# EAGLE design camera (EAGLE 9.6.2)
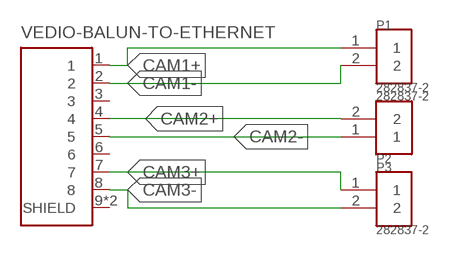
[diagram p0: schematic, sheet 1]

## Parts
P1  282837-2  [TE_282837-2]
P2  282837-2  [TE_282837-2]
P3  282837-2  [TE_282837-2]
VEDIO-BALUN-TO-ETHERNET  RJ45-8N-B  [TE_RJ45-8N-B]

## Nets
CAM1+: P1.1 VEDIO-BALUN-TO-ETHERNET.1
CAM1-: P1.2 VEDIO-BALUN-TO-ETHERNET.2
CAM2+: P2.2 VEDIO-BALUN-TO-ETHERNET.4
CAM2-: P2.1 VEDIO-BALUN-TO-ETHERNET.5
CAM3+: P3.1 VEDIO-BALUN-TO-ETHERNET.7
CAM3-: P3.2 VEDIO-BALUN-TO-ETHERNET.8
Unconnected: VEDIO-BALUN-TO-ETHERNET.3 VEDIO-BALUN-TO-ETHERNET.6 VEDIO-BALUN-TO-ETHERNET.9(SHIELD) VEDIO-BALUN-TO-ETHERNET.10(SHIELD)

## Library data of the parts
P1-P3 = block terminal:282837-2: TERM BLOCK 5.08MM 2POS SIDE ENTY Check availability <https://pricing.snapeda.com/parts/282837-2/TE%20Connectivity/view-part?ref=eda>; AVAILABILITY: In Stock; CHECK_PRICES: https://www.snapeda.com/parts/282837-2/TE+Connectivity+AMP+Connectors/view-part/?ref=eda; COMMENT: 282837-2; DESCRIPTION: Terminal Block Connector Wire Receptacle 2 5.08 mm 30-16 AWG Green 13.5 A 250 V | TE Connectivity 282837-2; MF: TE Connectivity; MP: 282837-2; PACKAGE: None; PRICE: None; SNAPEDA_LINK: https://www.snapeda.com/parts/282837-2/TE+Connectivity+AMP+Connectors/view-part/?ref=snap
VEDIO-BALUN-TO-ETHERNET = ethernet socket:RJ45-8N-B: Check availability <https://pricing.snapeda.com/parts/RJ45-8N-B/TE%20Connectivity/view-part?ref=eda>; AVAILABILITY: In Stock; CHECK_PRICES: https://www.snapeda.com/parts/RJ45-8N-B/TE+Connectivity+Corcom+Filters/view-part/?ref=eda; DESCRIPTION: Corcom FILTER SIGNAL LINE MODULAR 8CONTACTS 1 PORT THROUGH HOLE | TE Connectivity RJ45-8N-B; MF: TE Connectivity; MP: RJ45-8N-B; PACKAGE: None; PRICE: None; SNAPEDA_LINK: https://www.snapeda.com/parts/RJ45-8N-B/TE+Connectivity+Corcom+Filters/view-part/?ref=snap

## Board
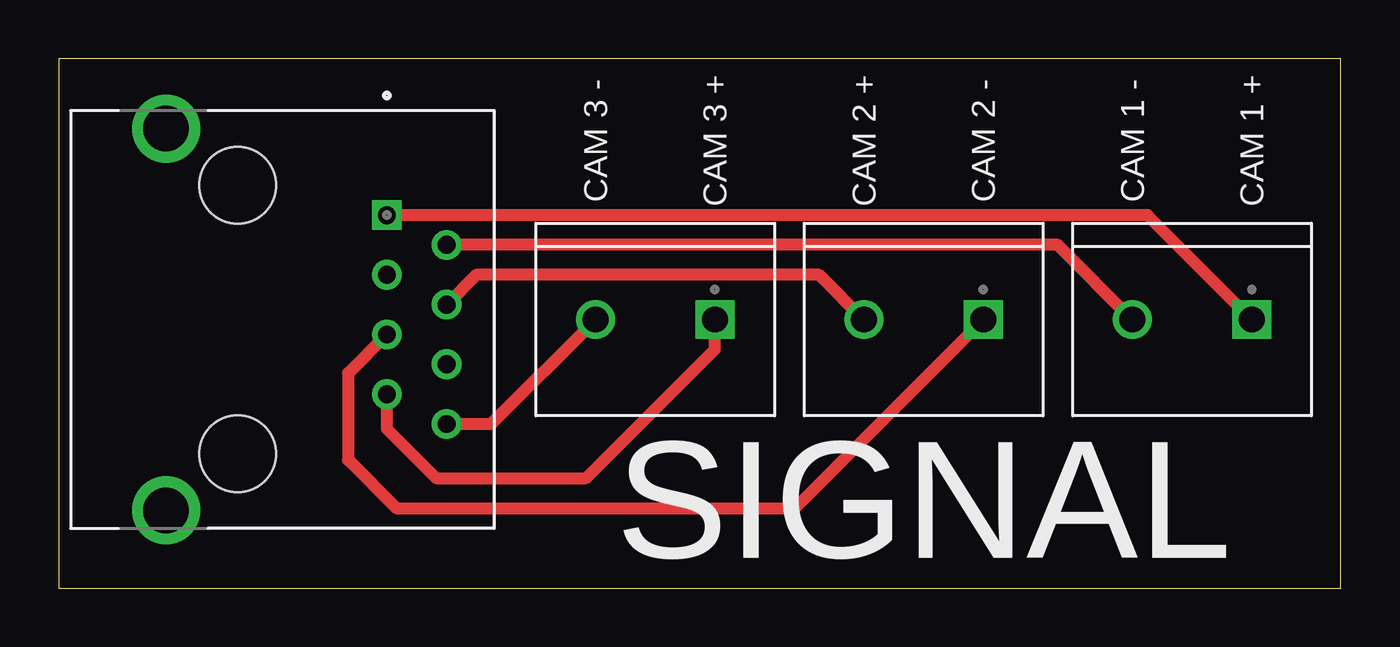
[diagram p1: board, top side]

Size 54.59 x 22.53 mm. Coordinates in mm from the lower left corner, seen from the top.
Outline: 0,0 54.59,0 54.59,22.53 0,22.53 0,0
Copper layers (1*16): Top 0.035mm / dielectric 1.5mm / Bottom 0.035mm
Design rules "default": minimum track width 6mil, minimum drill 0.35mm, track to track 6mil, track to pad 6mil, pad to pad 6mil, via to via 6mil, smd to smd 6mil, copper to edge 40mil, drill to drill 6mil, minimum pad ring 10mil, minimum via ring 8mil, stop-mask expansion 4mil, vias tented up to drill 0mil, thermal gap 10mil

### Footprints (pad centres in the part's own frame; a part is rotated, then mirrored left to right if it is on the bottom)
TE_282837-2 = drill 1.1 square: 1 -2.54,0 | drill 1.1: 2 2.54,0
TE_RJ45-8N-B = drill 0.76 square: 1 -4.445,6.35 | drill 0.76: 2 -3.175,8.89; 3 -1.905,6.35; 4 -0.635,8.89; 5 0.635,6.35; 6 1.905,8.89; 7 3.175,6.35; 8 4.445,8.89 | drill 1.93: 9 -8.125,-3.05; 10 8.125,-3.05 | hole 3.25: -5.715,0; 5.715,0

### Placement (x,y rotation side)
P1  48.26,11.43 180 top
P2  36.83,11.43 180 top
P3  25.4,11.43 180 top
VEDIO-BALUN-TO-ETHERNET  7.62,11.43 270 top

### Tracks (layer width: path | path; a pad name or v marks a point on that pad's centre or on a via)
CAM1+
  Top 0.508: P1.1 46.35,15.87 VEDIO-BALUN-TO-ETHERNET.1
CAM1-
  Top 0.508: VEDIO-BALUN-TO-ETHERNET.2 42.54,14.6 P1.2
CAM2+
  Top 0.508: P2.2 32.38,13.34 17.78,13.34 VEDIO-BALUN-TO-ETHERNET.4
CAM2-
  Top 0.508: VEDIO-BALUN-TO-ETHERNET.5 12.32,9.14 12.32,5.46 14.38,3.4 31.34,3.4 P2.1
CAM3+
  Top 0.508: VEDIO-BALUN-TO-ETHERNET.7 13.97,6.78 16.08,4.68 22.45,4.68 27.94,10.16 P3.1
CAM3-
  Top 0.508: VEDIO-BALUN-TO-ETHERNET.8 18.41,6.98 P3.2

### Text on the board
tPlace: CAM 3 - | CAM 3 + | CAM 2 + | CAM 2 - | CAM 1 - | CAM 1 + | SIGNAL